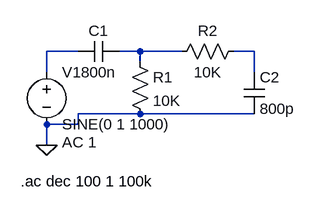
[diagram p0: schematic band pass filter.asc]
band pass filter.asc, the LTspice schematic file:
Version 4.1
SHEET 1 880 680
WIRE 112 96 64 96
WIRE 208 96 176 96
WIRE 272 96 208 96
WIRE 384 96 352 96
WIRE 208 112 208 96
WIRE 64 128 64 96
WIRE 384 128 384 96
WIRE 208 192 112 192
WIRE 384 192 208 192
WIRE 112 208 112 192
WIRE 112 208 64 208
WIRE 64 240 64 208
FLAG 64 240 0
SYMBOL cap 176 80 R90
WINDOW 0 0 32 VBottom 2
WINDOW 3 32 32 VTop 2
SYMATTR InstName C1
SYMATTR Value 800n
SYMATTR Description Capacitor
SYMATTR Type cap
SYMATTR SpiceLine V=63 Irms=1.3m Rser=3.1361 Lser=3.809n
SYMBOL res 192 96 R0
SYMATTR InstName R1
SYMATTR Value 10K
SYMATTR SpiceLine tol=1 pwr=0.1
SYMBOL res 368 80 R90
WINDOW 0 0 56 VBottom 2
WINDOW 3 32 56 VTop 2
SYMATTR InstName R2
SYMATTR Value 10K
SYMATTR SpiceLine tol=1 pwr=0.1
SYMBOL cap 368 128 R0
SYMATTR InstName C2
SYMATTR Value 800p
SYMBOL voltage 64 112 R0
WINDOW 123 24 124 Left 2
WINDOW 39 0 0 Left 0
SYMATTR InstName V1
SYMATTR Value SINE(0 1 1000)
SYMATTR Value2 AC 1
TEXT 24 296 Left 2 !.ac dec 100 1 100k

The netlist it stands for:
* band pass filter.asc
C1 N002 N001 800n V=63 Irms=1.3m Rser=3.1361 Lser=3.809n
R1 N002 0 10K tol=1 pwr=0.1
R2 N003 N002 10K tol=1 pwr=0.1
C2 N003 0 800p
V1 N001 0 SINE(0 1 1000) AC 1
.ac dec 100 1 100k
.backanno
.end